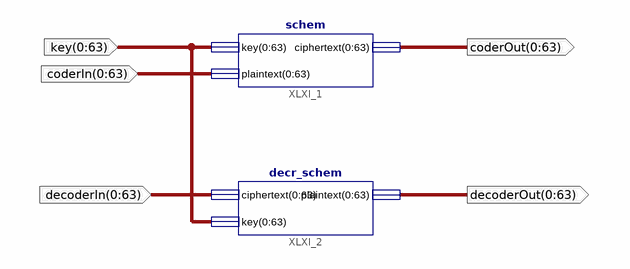
[diagram p0: schematic sheet 1]
// Xilinx ISE schematic main_schem.sch (spartan3e) as structural Verilog: 2 symbols, 5 ports
module main_schem (
  input  [0:63] coderIn,
  input  [0:63] decoderIn,
  input  [0:63] key,
  output [0:63] decoderOut,
  output [0:63] coderOut
);

  schem XLXI_1 (.key(key), .plaintext(coderIn), .ciphertext(coderOut));
  decr_schem XLXI_2 (.ciphertext(decoderIn), .key(key), .plaintext(decoderOut));
endmodule
